# Altium schematic sheet ISO_12V_to_20V.SchDoc
size A4; SheetNumber: 3; SheetTotal: 8
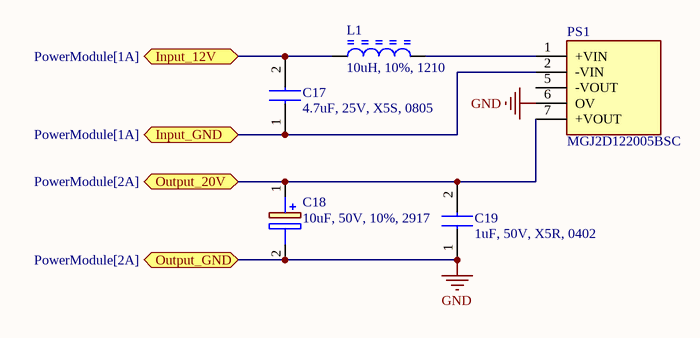
[diagram p0: ISO_12V_to_20V.SchDoc]

## Parts
C17  4.7uF, 25V, X5S, 0805  [CAPC2012X145N]
C18  10uF, 50V, 10%, 2917  [T491D]
C19  1uF, 50V, X5R, 0402  [GRM15x]
L1  10uH, 10%, 1210  [BOUR-CM322522_V]
PS1  MGJ2D122005BSC  [MGJ2D122005BSC]

## Ports
Input_12V (bidir, see PowerModule[1A]), Input_GND (bidir, see PowerModule[1A]), Output_20V (bidir, see PowerModule[2A]), Output_GND (bidir, see PowerModule[2A])

## Nets
GND: C18.2(-) C19.1 PS1.6(OV) ; port Output_GND
Input_12V: C17.2 L1.1 ; port Input_12V
Input_GND: C17.1 PS1.2(-VIN) ; port Input_GND
Output_20V: C18.1(+) C19.2 PS1.7(+VOUT) ; port Output_20V
NetL1_2: L1.2 PS1.1(+VIN)

Not connected (* = marked no-connect by the designer): PS1 5(-VOUT)

## Library data of the parts
C17 = GRM21BC71E475KE11L: Capacitor; Manufacturer_Name: Murata Electronics; Datasheet Link: https://search.murata.co.jp/Ceramy/image/img/A01X/G101/ENG/GRM21BC71E475KE11-01A.pdf; Height: 1.45mm; Manufacturer_Part_Number: GRM21BC71E475KE11L; Mouser Part Number: 81-GRM21BC71E475KE1L; Mouser Price/Stock: https://www.mouser.co.uk/ProductDetail/Murata-Electronics/GRM21BC71E475KE11L?qs=hNud%2FORuBR02yf5e5nzFMA%3D%3D; Arrow Part Number: GRM21BC71E475KE11L; Arrow Price/Stock: https://www.arrow.com/en/products/grm21bc71e475ke11l/murata-manufacturing
C18 = T491D106K050AT: Capacitor Polarised; Manufacturer_Name: KEMET; Datasheet Link: https://content.kemet.com/datasheets/KEM_T2005_T491.pdf; Height: 3.1mm; Manufacturer_Part_Number: T491D106K050AT; Mouser Part Number: 80-T491D106K050; Mouser Price/Stock: https://www.mouser.co.uk/ProductDetail/KEMET/T491D106K050AT?qs=ohfon0hxEDckuN%2F%252ByCig%2FQ%3D%3D; Arrow Part Number: T491D106K050AT; Arrow Price/Stock: https://www.arrow.com/en/products/t491d106k050at/kemet-corporation?region=nac
C19 = GRM155R61H105KE05J: Capacitor; Manufacturer_Name: Murata Electronics; Datasheet Link: https://search.murata.co.jp/Ceramy/image/img/A01X/G101/ENG/GRM155R61H105KE05-01A.pdf; Height: 0.33mm; Manufacturer_Part_Number: GRM155R61H105KE05J; Mouser Part Number: 81-GRM155R61H105KE5J; Mouser Price/Stock: https://www.mouser.co.uk/ProductDetail/Murata-Electronics/GRM155R61H105KE05J?qs=d0WKAl%252BL4KZilUxqJ3m7lA%3D%3D; Arrow Part Number: GRM155R61H105KE05J; Arrow Price/Stock: https://www.arrow.com/en/products/grm155r61h105ke05j/murata-manufacturing?region=nac
L1 = CMP-1747-00008-1: Chip Inductor / , 10 uH, +/- 10%, -40 to 125 degC, 1210 (3225 Metric), RoHS, Tape and Reel; Current Rating: 1.5 A; Colour: White; Gender: Female; Connector Type: USB; Min Operating Temperature: -55 degC; ComponentLink2Description: Datasheet; Packaging: Tray; Contact Material: Bronze; ComponentLink1Description: Manufacturer URL; PackageDescription: 2-Pin Surface Mount Device, Body 3.2 x 2.5 mm; Contact Plating: Gold; Max Operating Temperature: 85 degC; ComponentLink2URL: http://www.bourns.com/docs/Product-Datasheets/cm322522.pdf; PackageReference: 1210; Radiation Hardening: No; DatasheetVersion: Aug-14; Package Quantity: 100; Pins: 4; Mount: Through Hole; Lead Pitch: 2.5 mm; ComponentLink1URL: http://www.bourns.com/; Height: 15.9 mm; RoHSCompliant: true; Width: 11.15 mm
PS1 = MGJ2D122005BSC: Power Supply; Manufacturer_Name: Murata Electronics; Datasheet Link: https://www.murata.com/products/productdata/8822318989342/KDC-MGJ2B.pdf?1690255813000; Height: 12.75mm; Manufacturer_Part_Number: MGJ2D122005BSC